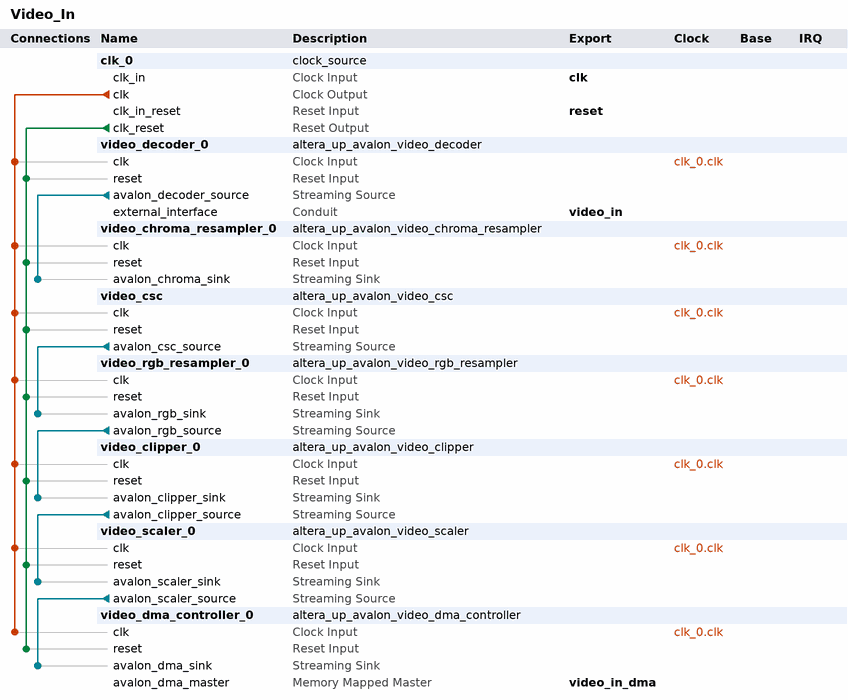
[diagram p0: system contents]
# Platform Designer (Qsys) system Video_In, Cyclone IV E EP4CE115F29C8
# Parameters at their usual value, and those the tool derives, are not listed.
package require -exact qsys 16.1
create_system Video_In
set_project_property DEVICE_FAMILY {Cyclone IV E}
set_project_property DEVICE EP4CE115F29C8

add_instance clk_0 clock_source 16.1
set_instance_parameter_value clk_0 clockFrequency 50000000

add_instance video_decoder_0 altera_up_avalon_video_decoder 16.1

add_instance video_chroma_resampler_0 altera_up_avalon_video_chroma_resampler 16.1

add_instance video_csc altera_up_avalon_video_csc 16.1

add_instance video_rgb_resampler_0 altera_up_avalon_video_rgb_resampler 16.1
set_instance_parameter_value video_rgb_resampler_0 alpha 1023
set_instance_parameter_value video_rgb_resampler_0 input_type {24-bit RGB}
set_instance_parameter_value video_rgb_resampler_0 output_type {8-bit Grayscale}

add_instance video_clipper_0 altera_up_avalon_video_clipper 16.1
set_instance_parameter_value video_clipper_0 color_bits 8
set_instance_parameter_value video_clipper_0 color_planes 1

add_instance video_scaler_0 altera_up_avalon_video_scaler 16.1
set_instance_parameter_value video_scaler_0 color_bits 8
set_instance_parameter_value video_scaler_0 color_planes 1
set_instance_parameter_value video_scaler_0 height_scaling 2
set_instance_parameter_value video_scaler_0 width_in 640
set_instance_parameter_value video_scaler_0 width_scaling 1

add_instance video_dma_controller_0 altera_up_avalon_video_dma_controller 16.1
set_instance_parameter_value video_dma_controller_0 addr_mode Consecutive
set_instance_parameter_value video_dma_controller_0 back_start_address 0
set_instance_parameter_value video_dma_controller_0 color_bits 8
set_instance_parameter_value video_dma_controller_0 color_planes 1
set_instance_parameter_value video_dma_controller_0 dma_enabled true
set_instance_parameter_value video_dma_controller_0 height 480
set_instance_parameter_value video_dma_controller_0 mode {From Stream to Memory}
set_instance_parameter_value video_dma_controller_0 start_address 9437184
set_instance_parameter_value video_dma_controller_0 width 640

# connections
add_connection clk_0.clk video_chroma_resampler_0.clk clock
add_connection clk_0.clk video_clipper_0.clk clock
add_connection clk_0.clk video_csc.clk clock
add_connection clk_0.clk video_decoder_0.clk clock
add_connection clk_0.clk video_dma_controller_0.clk clock
add_connection clk_0.clk video_rgb_resampler_0.clk clock
add_connection clk_0.clk video_scaler_0.clk clock
add_connection clk_0.clk_reset video_chroma_resampler_0.reset reset
add_connection clk_0.clk_reset video_clipper_0.reset reset
add_connection clk_0.clk_reset video_csc.reset reset
add_connection clk_0.clk_reset video_decoder_0.reset reset
add_connection clk_0.clk_reset video_dma_controller_0.reset reset
add_connection clk_0.clk_reset video_rgb_resampler_0.reset reset
add_connection clk_0.clk_reset video_scaler_0.reset reset
add_connection video_clipper_0.avalon_clipper_source video_scaler_0.avalon_scaler_sink avalon_streaming
add_connection video_csc.avalon_csc_source video_rgb_resampler_0.avalon_rgb_sink avalon_streaming
add_connection video_decoder_0.avalon_decoder_source video_chroma_resampler_0.avalon_chroma_sink avalon_streaming
add_connection video_rgb_resampler_0.avalon_rgb_source video_clipper_0.avalon_clipper_sink avalon_streaming
add_connection video_scaler_0.avalon_scaler_source video_dma_controller_0.avalon_dma_sink avalon_streaming

# exported interfaces
add_interface clk clock sink
set_interface_property clk EXPORT_OF clk_0.clk_in
add_interface reset reset sink
set_interface_property reset EXPORT_OF clk_0.clk_in_reset
add_interface video_in conduit end
set_interface_property video_in EXPORT_OF video_decoder_0.external_interface
add_interface video_in_dma avalon master
set_interface_property video_in_dma EXPORT_OF video_dma_controller_0.avalon_dma_master

set_interconnect_requirement {$system} qsys_mm.clockCrossingAdapter HANDSHAKE
set_interconnect_requirement {$system} qsys_mm.enableEccProtection FALSE
set_interconnect_requirement {$system} qsys_mm.insertDefaultSlave FALSE
set_interconnect_requirement {$system} qsys_mm.maxAdditionalLatency 1

save_system Video_In.qsys
